# Altium schematic sheet SDEC944-xD_Alimentation_2-2.SchDoc: Alimentation 2/2
size 393 x 270 mm; CompanyName: Seccom; Address1: 521, rue du capt. François Garbit; Address2: 69440 Mornant; Address3: seccom@seccom.fr; Address4: www.seccom.fr; DocumentNumber: 3; SheetNumber: 3; SheetTotal: 22; PageSetup: Record=PageOptions|CenterHorizontal=True|CenterVertical=True|PrintScale=0.74|XCorrection=1.00|YCorrection=1.00|PrintKind=0|BorderSize=5000000|LeftOffset=0|BottomOffset=0|Orientation=2|PaperLength=1000|PaperWidth=1000|Scale=100|PaperSource=7|PrintQuality=-4|MediaType=1|DitherType=10|PaperKind=A4|PrintScaleMode=1
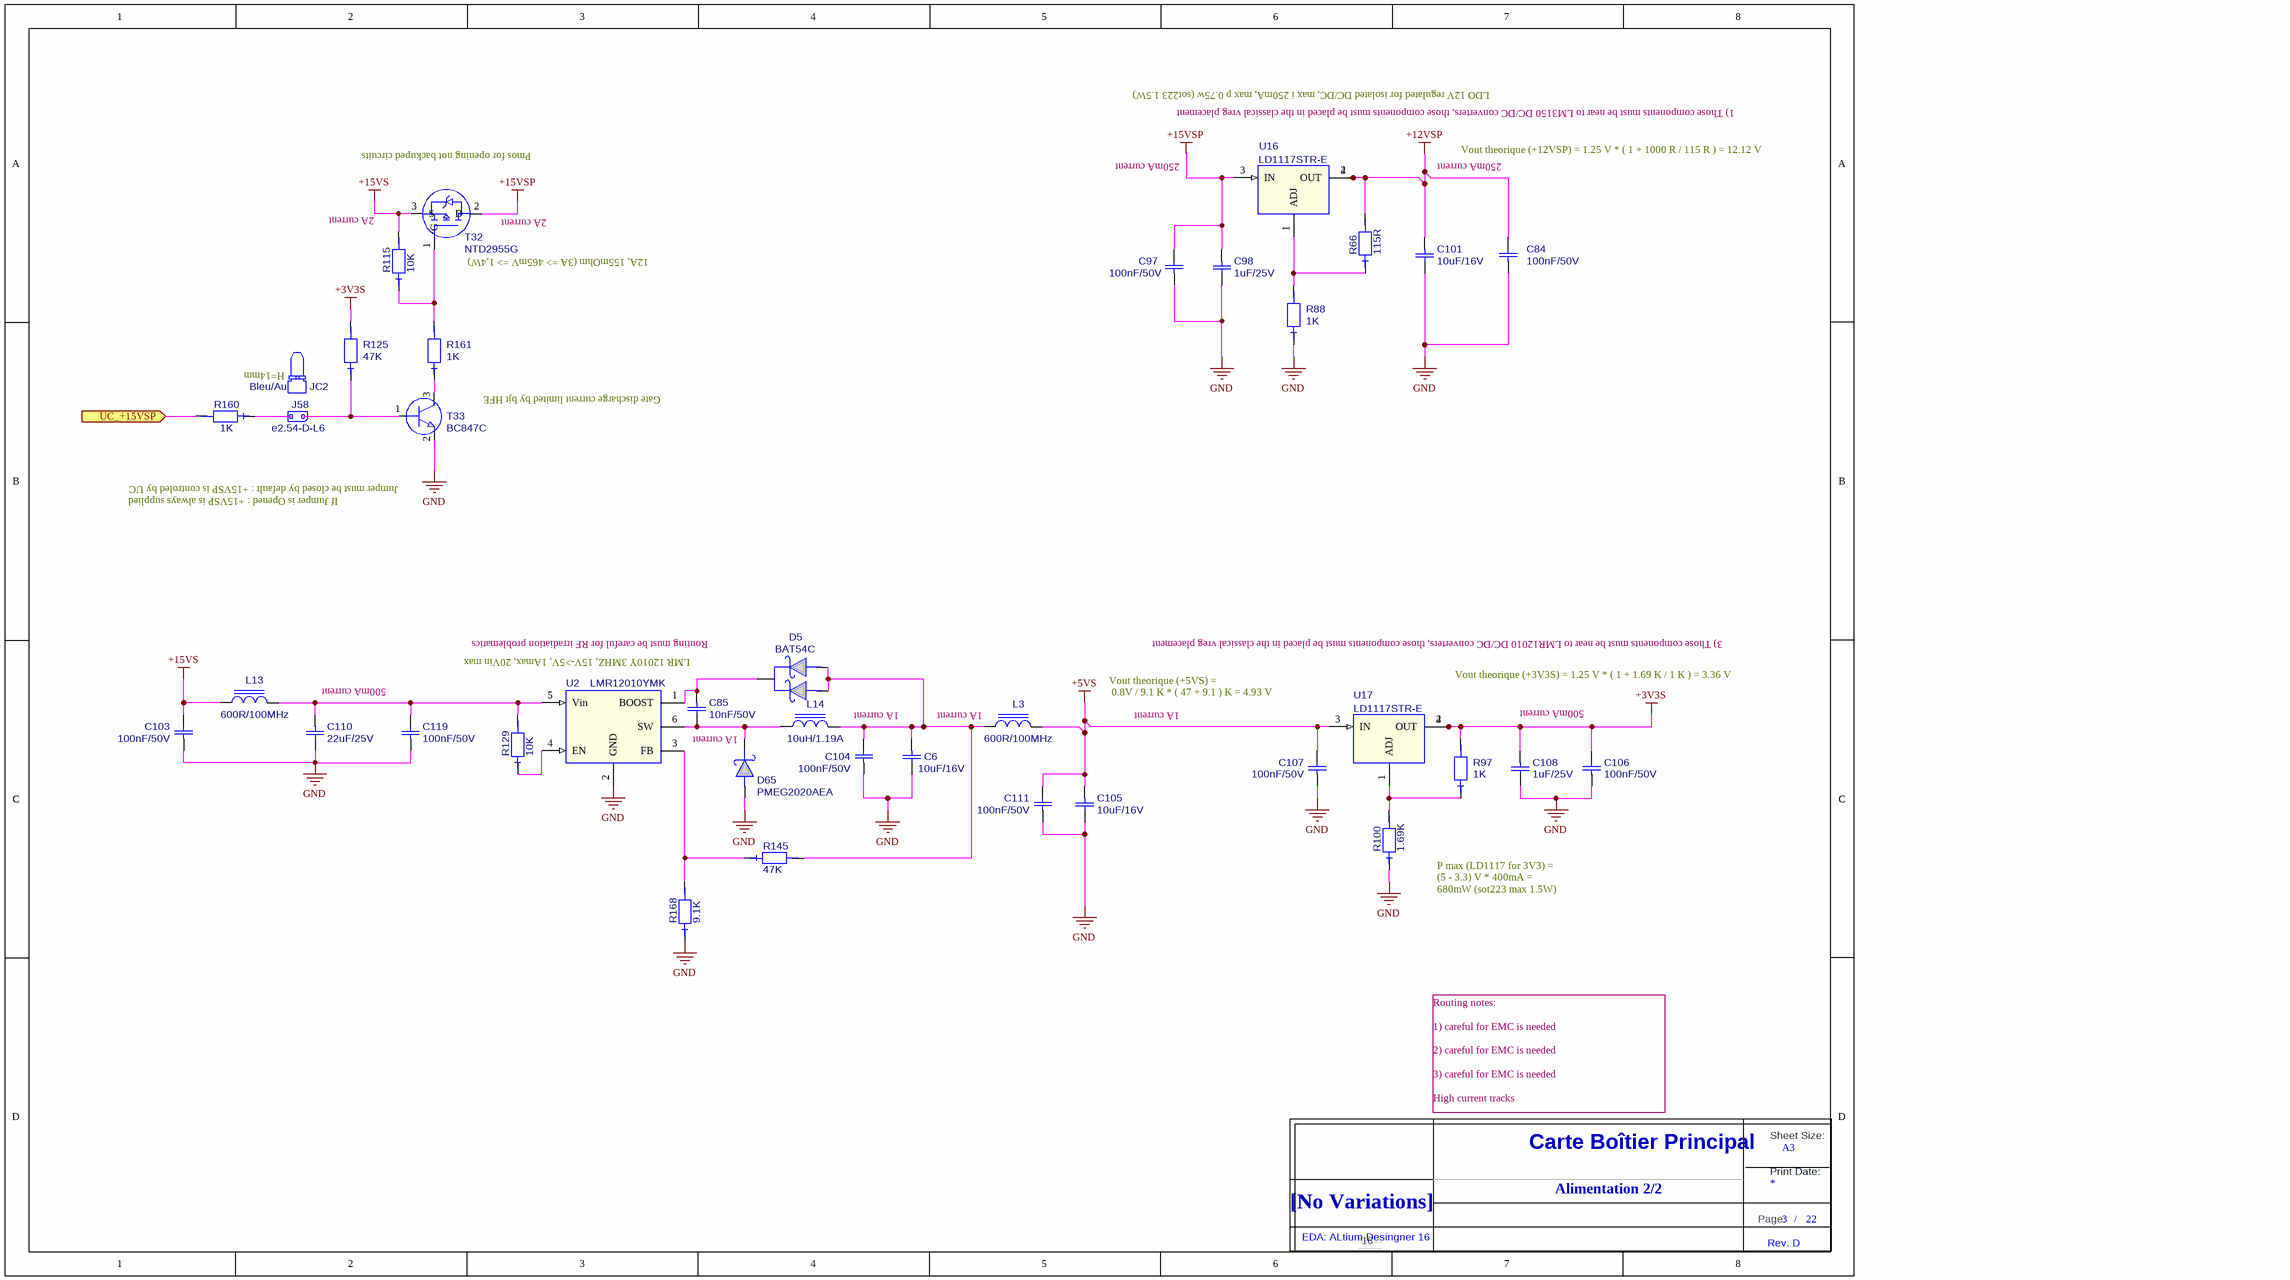
[diagram p0: SDEC944-xD_Alimentation_2-2.SchDoc]

## Parts
C6  value 10uF/16V  [0805_ReflowSoldering_CAP]  (hidden comment: C_0805_X5R_10%_10U-16V)
C84  value 100nF/50V  [0603_ReflowSoldering_CAP]  (hidden comment: C_0603_X7R_10%_100N-50V)
C85  value 10nF/50V  [0603_ReflowSoldering_CAP]  (hidden comment: C_0603_X7R_10%_10N-50V)
C97  value 100nF/50V  [0603_ReflowSoldering_CAP]  (hidden comment: C_0603_X7R_10%_100N-50V)
C98  value 1uF/25V  [0805_ReflowSoldering_CAP]  (hidden comment: C_0805_X5R_10%_1U-25V)
C101  value 10uF/16V  [0805_ReflowSoldering_CAP]  (hidden comment: C_0805_X5R_10%_10U-16V)
C103  value 100nF/50V  [0603_ReflowSoldering_CAP]  (hidden comment: C_0603_X7R_10%_100N-50V)
C104  value 100nF/50V  [0603_ReflowSoldering_CAP]  (hidden comment: C_0603_X7R_10%_100N-50V)
C105  value 10uF/16V  [0805_ReflowSoldering_CAP]  (hidden comment: C_0805_X5R_10%_10U-16V)
C106  value 100nF/50V  [0603_ReflowSoldering_CAP]  (hidden comment: C_0603_X7R_10%_100N-50V)
C107  value 100nF/50V  [0603_ReflowSoldering_CAP]  (hidden comment: C_0603_X7R_10%_100N-50V)
C108  value 1uF/25V  [0805_ReflowSoldering_CAP]  (hidden comment: C_0805_X5R_10%_1U-25V)
C110  value 22uF/25V  [1206_ReflowSoldering_CAP]  (hidden comment: C_1206_X5R_20%_22U-25V)
C111  value 100nF/50V  [0603_ReflowSoldering_CAP]  (hidden comment: C_0603_X7R_10%_100N-50V)
C119  value 100nF/50V  [0603_ReflowSoldering_CAP]  (hidden comment: C_0603_X7R_10%_100N-50V)
D5  BAT54C  [SOT23_3L_ReflowSoldering]
D65  PMEG2020AEA  [SOD323_ReflowSoldering]
J58  value e2.54-D-L6  [BAR_M_1X02D_L6_IS2.6_E2.54_G]  (hidden comment: CAVALIER_EMBASE_2PTS_E2.54)
JC2  value Bleu/Au  [NULL]  (hidden comment: CAVALIER_2.54_BLEU_DORE_LANGUETTE_14mm)
L3  value 600R/100MHz  [1206_ReflowSoldering_FERRITE]  (hidden comment: IND_FERRITE_1206_74279218)
L13  value 600R/100MHz  [1206_ReflowSoldering_FERRITE]  (hidden comment: IND_FERRITE_1206_74279218)
L14  value 10uH/1.19A  [SELF_WE-TPC_4.8x4.78_(type4828)]  (hidden comment: SELF_10UH_1.19A_744043100)
R66  value 115R  [0603_ReflowSoldering_RES]  (hidden comment: RES_0603_1%_100PPM_115R)
R88  value 1K  [0603_ReflowSoldering_RES]  (hidden comment: RES_0603_1%_100PPM_1K)
R97  value 1K  [0603_ReflowSoldering_RES]  (hidden comment: RES_0603_1%_100PPM_1K)
R100  value 1.69K  [0603_ReflowSoldering_RES]  (hidden comment: RES_0603_1%_100PPM_1.69K)
R115  value 10K  [0603_ReflowSoldering_RES]  (hidden comment: RES_0603_1%_100PPM_10K)
R125  value 47K  [0603_ReflowSoldering_RES]  (hidden comment: RES_0603_1%_100PPM_47K)
R129  value 10K  [0603_ReflowSoldering_RES]  (hidden comment: RES_0603_1%_100PPM_10K)
R145  value 47K  [0603_ReflowSoldering_RES]  (hidden comment: RES_0603_1%_100PPM_47K)
R160  value 1K  [0603_ReflowSoldering_RES]  (hidden comment: RES_0603_1%_100PPM_1K)
R161  value 1K  [0603_ReflowSoldering_RES]  (hidden comment: RES_0603_1%_100PPM_1K)
R168  value 9.1K  [0603_ReflowSoldering_RES]  (hidden comment: RES_0603_1%_100PPM_9.1K)
T32  NTD2955G  [DPAK_Specifique_1]
T33  BC847C  [SOT23_3L_ReflowSoldering]
Title_new  DNI  (value not drawn)  (graphical)
U2  LMR12010YMK  [SOT23_6L]
U16  LD1117STR-E  [SOT223]
U17  LD1117STR-E  [SOT223]

## Ports
UC_+15VSP (in)

## Nets
+3V3S: C106.1 C108.2 R97.2 R125.2 U17.2(OUT) U17.4(OUT)
+5VS: C105.2 C107.1 C111.1 L3.2 U17.3(IN)
+12VSP: C84.1 C101.2 R66.2 U16.2(OUT) U16.4(OUT)
+15VS: C103.1 L13.1 R115.2 T32.3(S)
+15VSP: C97.1 C98.2 T32.2(D) U16.3(IN)
GND: C6.1 C84.2 C97.2 C98.1 C101.1 C103.2 C104.2 C105.1 C106.2 C107.2 C108.1 C110.1 C111.2 C119.2 D65.A R88.1 R100.1 R168.1 T33.2(E) U2.2(GND)
UC_+15VSP: R160.2 ; port UC_+15VSP
NetC6_2: C6.2 C104.1 D5.1 D5.2 L3.1 L14.2 R145.2
NetC85_1: C85.1 D65.K L14.1 U2.6(SW)
NetC85_2: C85.2 D5.3 U2.1(BOOST)
NetC110_2: C110.2 C119.1 L13.2 R129.2 U2.5(Vin)
NetJ58_1: J58.1 R125.1 T33.1(B)
NetJ58_2: J58.2 R160.1
NetR66_1: R66.1 R88.2 U16.1(ADJ)
NetR97_1: R97.1 R100.2 U17.1(ADJ)
NetR115_1: R115.1 R161.2 T32.1(G)
NetR129_1: R129.1 U2.4(EN)
NetR145_1: R145.1 R168.2 U2.3(FB)
NetR161_1: R161.1 T33.3(C)

Not connected (* = marked no-connect by the designer): L14 3 4 5 6

## Notes on the sheet
- LDO 12V regulated for isolated DC/DC, max i 250mA, max p 0.75w (sot223 1.5W)
- 1) Those components must be near to LM3150 DC/DC converters, those components must be placed in the classical vreg placement
- Pmos for opening not backuped circuits
- 250mA current
- Vout theorique (+12VSP) = 1.25 V * ( 1 + 1000 R / 115 R ) = 12.12 V
- 2A current
- (near T32) 2A current
- (near T32) 12A, 155mOhm (3A => 465mV => 1,4W)
- (near JC2) H=14mm
- (near T33) Gate discharge current limited by bjt HFE
- If Jumper is Opened : +15VSP is always supplied
- Jumper must be closed by default : +15VSP is controled by UC
- Routing must be careful for RF irradiation problematics
- 3) Those components must be near to LMR12010 DC/DC converters, those components must be placed in the classical vreg placement
- 500mA current
- LMR 12010Y 3MHZ, 15V->5V, 1Amax, 20Vin max
- 1A current
- (near L3) 1A current
- Vout theorique (+5VS) =
  0.8V / 9.1 K * ( 47 + 9.1 ) K = 4.93 V
- Vout theorique (+3V3S) = 1.25 V * ( 1 + 1.69 K / 1 K ) = 3.36 V
- P max (LD1117 for 3V3) =
  (5 - 3.3) V * 400mA =
  680mW (sot223 max 1.5W)
- Routing notes:
  1) careful for EMC is needed
  2) careful for EMC is needed
  3) careful for EMC is needed
  High current tracks
- Alimentation 2/2
- 16
- (in symbol Title_new) Sheet Size:; Carte Boîtier Principal; A3; Print Date:; [No Variations]; Page:; /; EDA: ALtium Desingner 16; Rev. D

## Library data of the parts
C6 C101 C105 = C_0805_X5R_10%_10U-16V: Condensateur céramique, X5R, 10%, CMS 0805, 10uF/16V; Creation: FB (02/10/12); Boitier: 0805; Remarque: {Remarque}; Coeff: 1; Fabricant: Kemet; Ref Fab: C0805C106K4PAC; Verification: *; ComponentLink1URL: O:\_Documentation\Datasheets\Kemet\Condos_Ceramic_CMS.pdf; ComponentLink2URL: o:\_Documentation\Datasheets\_Boitiers\PASSIF_CMS\RC_0805_(2x1,25)_(Schneider).pdf; Config: *; ComponentLink1Description: Datasheet; ComponentLink2Description: Datasheet Boitier
C84 C97 C103 C104 C106 C107 C111 C119 = C_0603_X7R_10%_100N-50V: Condensateur céramique, X7R, 10%, CMS 0603, 100nF/50V; Creation: FB (29/02/12); Boitier: 0603; Remarque: {Remarque}; Fabricant: Kemet; Ref Fab: C0603C104K5RAC; Coeff: 1; ComponentLink1URL: O:\_Documentation\Datasheets\Kemet\Condos_Ceramic_CMS.pdf; ComponentLink2URL: o:\_Documentation\Datasheets\_BOITIERS\PASSIF_CMS\; Config: *; ComponentLink1Description: Datasheet; ComponentLink2Description: Datasheet Boitier; Supplier 1: Farnell; Supplier Part Number 1: 1288255
C85 = C_0603_X7R_10%_10N-50V: Condensateur céramique, X7R, 10%, CMS 0603; Creation: CHD; Boitier: 0603; Remarque: {Remarque}; Coeff: 1; Fabricant: Kemet; Ref Fab: C0603C103K5RAC; ComponentLink1URL: o:\_Documentation\Datasheets\Kemet\Condos_Ceramic_CMS.pdf; ComponentLink2URL: o:\_Documentation\Datasheets\_BOITIERS\PASSIF_CMS\; Config: *; ComponentLink1Description: Datasheet; ComponentLink2Description: Datasheet Boitier; Supplier 1: Farnell; Supplier Part Number 1: 1414609
C98 C108 = C_0805_X5R_10%_1U-25V: Condensateur céramique, X5R, 10%, CMS 0805; Creation: FB (07/03/12); Reference: 001834/00; Boitier: 0805; Remarque: {Remarque}; Coeff: 1; Fabricant: AVX; Ref Fab: 08053D105KAT2A; Verification: *; ComponentLink1URL: O:\_Documentation\Datasheets\AVX\Condensateurs_CMS_Ceramic_X5R.pdf; ComponentLink2URL: o:\_Documentation\Datasheets\_Boitiers\PASSIF_CMS\RC_0805_(2x1,25)_(Schneider).pdf; Config: *; ComponentLink1Description: Datasheet; ComponentLink2Description: Datasheet Boitier; Supplier Part Number 1: 1327695; Supplier Part Number 2: 6983409; Supplier 1: Farnell; Supplier 2: Radiospares
C110 = C_1206_X5R_20%_22U-25V: Condensateur céramique, X5R, 20%, CMS 1206, 22uF/25V; Creation: ZA (18/12/13); Reference: /01; Boitier: 1206; Remarque: {Remarque}; Fabricant: TDK; Coeff: 1; Ref Fab: C3216X5R1E226M160AB; Verification: *; ComponentLink1URL: O:\_Documentation\Datasheets\TDK\general_B11.pdf; ComponentLink2URL: o:\_Documentation\Datasheets\_BOITIERS\PASSIF_CMS\; ComponentLink1Description: Datasheet; ComponentLink2Description: Datasheet Boitier; Supplier 1: Farnell; Supplier Part Number 1: 2354129; Supplier 2: Mouser; Supplier Part Number 2: 810-C3216X5R1E226M
D5 = BAT54C: Diode Schottky double, BAT54 cathode com, Vrrm=30V, If=300mA, Vf=0.4Vmax, CMS; Creation: LJ (14/05/02); Reference: 000597/00; Boitier: SOT23_3L; Remarque: {Remarque}; Coeff: 1; Fabricant: NXP; Verification: LJ (14/05/02); ComponentLink1URL: O:\_Documentation\Datasheets\NXP\BAT54_series.pdf; ComponentLink2URL: o:\_Documentation\Datasheets\_BOITIERS\ACTIF_CMS\SOT\SOT_23_3P_(Schneider).PDF; Config: *; ComponentLink1Description: Datasheet; ComponentLink2Description: Datasheet Boitier; Ref Fab: BAT54C; Supplier 1: Farnell; Supplier Part Number 1: 1081192; Value: BAT54C
D65 = PMEG2020AEA: Diode Schottky, Vrrm=20V, If=2A, Vf=0.45V, CMS; Creation: PDP (10/07/12); Boitier: SOD323; Remarque: {Remarque}; Coeff: 1; Fabricant: NXP; Verification: *; ComponentLink1URL: o:\_Documentation\Datasheets\NXP\PMEG2020AEA.PDF; ComponentLink2URL: o:\_Documentation\Datasheets\_BOITIERS\ACTIF_CMS\SOD\SOD_80_(MLL34)_(Schneider).PDF; Config: *; ComponentLink1Description: Datasheet; ComponentLink2Description: Datasheet Boitier; Ref Fab: PMEG2020AEA; Value: PMEG2020AEA
J58 = CAVALIER_EMBASE_2PTS_E2.54: Barrette, e2.54, mâle, 1x2 picots 0.635², droit, long. contact 6, isol. 2.6mm, doré; Creation: LJ; Reference: 000048/02; Boitier: 1x02_e2.54_drt_L6mm; Remarque: Longueur contact idéale pour accueillir HE10; Verification: LJ (13/11/03); Coeff: 1; Fabricant: Samtec; Ref Fab: TSW-102-24-L-S; ComponentLink1URL: o:\_Documentation\Datasheets\Samtec\TSW_TH.PDF; Config: *; ComponentLink1Description: Datasheet; ComponentLink2Description: Datasheet Boitier
JC2 = CAVALIER_2.54_BLEU_DORE_LANGUETTE_14mm: Cavalier (Jumper) doré 2 points pour barrette au pas de 2.54mm, BLEU, avec languette, Hauteur globale 14mm, 3A, 250V; Creation: ZA (07/11/12); Boitier: 5.08x2.54_h14_e2.54mm; Remarque: {Remarque}; Coeff: 1; Fabricant: Harwin; Ref Fab: M7683-05; ComponentLink1URL: o:\_Documentation\Datasheets\Harwin\M7680-M7683.pdf; ComponentLink2URL: o:\_Documentation\Datasheets\Harwin\M7680-M7683.pdf; Config: *; ComponentLink2Description: Datasheet Boitier; ComponentLink1Description: Datasheet; Supplier 1: Farnell; Supplier Part Number 1: 3218466; Supplier 2: Mouser; Supplier Part Number 2: 855-M7683-05
L3 L13 = IND_FERRITE_1206_74279218: Inductance à ferrite multicouches CMS, imp=600R@100MHz, +/-25%, Rdc=100mR, I=2A; Creation: LJ (12/08/08); Reference: 000049/00; Boitier: 1206; Remarque: Alternative aux selfs de choc; Coeff: 1; Fabricant: Wurth Elektronik; Verification: *; ComponentLink1URL: o:\_Documentation\Datasheets\Wurth_Elektronik\74279218.pdf; ComponentLink2URL: o:\_Documentation\Datasheets\_Boitiers\PASSIF_CMS\RC_1206_(3,2x1,6)_(Schneider).pdf; Config: *; ComponentLink1Description: Datasheet; ComponentLink2Description: Datasheet Boitier; Ref Fab: 74279218
L14 = SELF_10UH_1.19A_744043100: Inductance bobinée CMS, 10uH +/- 10%, I=1.19A, Rdc=0.095R, SRF=40MHz, -40/+85°C; Creation: LJ (02/08/12); Boitier: 4.8x4.8_h2.8mm; Coeff: 1; Fabricant: Wurth Elektronik; Verification: *; ComponentLink1URL: O:\_Documentation\Datasheets\Wurth_Elektronik\744043100.pdf; ComponentLink2URL: O:\_Documentation\Datasheets\Wurth_Elektronik\744043100.pdf; Remarque: *; Config: *; ComponentLink1Description: Datasheet; ComponentLink2Description: Datasheet Boitier; Ref Fab: 744043100
R66 = RES_0603_1%_100PPM_115R: Résistance, 0.100W, 1%, 100ppm, 75V, 115R; Creation: PDP (03/10/12); Boitier: 0603; Remarque: {Remarque}; Fabricant: Vishay; Ref Fab: CRCW0603115RFKEA; Coeff: 1; Verification: *; ComponentLink1URL: O:\_Documentation\Datasheets\Vishay\Resistances_D-CRCWe3.pdf; ComponentLink2URL: o:\_Documentation\Datasheets\_BOITIERS\PASSIF_CMS\; Config: *; ComponentLink1Description: Datasheet; ComponentLink2Description: Datasheet Boitier; Supplier 1: Mouser; Supplier Part Number 1: 71-CRCW0603-115-E3; Supplier 2: Farnell; Supplier Part Number 2: 2141284
R88 R97 R160 R161 = RES_0603_1%_100PPM_1K: Résistance, 0.100W, 1%, 100ppm, 75V, 1K; Creation: JPL (05/07/12); Boitier: 0603; Remarque: {Remarque}; Fabricant: Vishay; Ref Fab: CRCW06031K00FKEA; Coeff: 1; Verification: *; ComponentLink1URL: O:\_Documentation\Datasheets\Vishay\Resistances_D-CRCWe3.pdf; ComponentLink2URL: o:\_Documentation\Datasheets\_BOITIERS\PASSIF_CMS\; Config: *; ComponentLink1Description: Datasheet; ComponentLink2Description: Datasheet Boitier; Supplier 1: Farnell; Supplier 2: RadioSpares; Supplier Part Number 1: 1469740; Supplier Part Number 2: 6789875
R100 = RES_0603_1%_100PPM_1.69K: Résistance, 0.100W, 1%, 100ppm, 75V, 1.69K; Creation: PDP (03/10/12); Boitier: 0603; Remarque: {Remarque}; Fabricant: Vishay; Ref Fab: CRCW06031K69FKEA; Coeff: 1; Verification: *; ComponentLink1URL: O:\_Documentation\Datasheets\Vishay\Resistances_D-CRCWe3.pdf; ComponentLink2URL: o:\_Documentation\Datasheets\_BOITIERS\PASSIF_CMS\; Config: *; ComponentLink1Description: Datasheet; ComponentLink2Description: Datasheet Boitier; Supplier 1: Farnell; Supplier Part Number 1: 1692520; Supplier 2: Mouser; Supplier Part Number 2: 71-CRCW0603-1.69K-E3
R115 R129 = RES_0603_1%_100PPM_10K: Résistance, 0.100W, 1%, 100ppm, 75V, 10K; Creation: JPL (05/07/12); Boitier: 0603; Remarque: {Remarque}; Coeff: 1; Fabricant: Vishay; Ref Fab: CRCW060310K0FKEA; Verification: *; ComponentLink1URL: O:\_Documentation\Datasheets\Vishay\Resistances_D-CRCWe3.pdf; ComponentLink2URL: o:\_Documentation\Datasheets\_BOITIERS\PASSIF_CMS\; Config: *; ComponentLink1Description: Datasheet; ComponentLink2Description: Datasheet Boitier; Supplier 1: Farnell; Supplier Part Number 1: 1469748; Supplier 2: RadioSpares; Supplier Part Number 2: 6789667
R125 R145 = RES_0603_1%_100PPM_47K: Résistance, 0.100W, 1%, 100ppm, 75V, 47K; Creation: JPL (05/07/12); Boitier: 0603; Remarque: {Remarque}; Fabricant: Vishay; Ref Fab: CRCW060347K0FKEA; Coeff: 1; Verification: *; ComponentLink1URL: O:\_Documentation\Datasheets\Vishay\Resistances_D-CRCWe3.pdf; ComponentLink2URL: o:\_Documentation\Datasheets\_BOITIERS\PASSIF_CMS\; Config: *; ComponentLink1Description: Datasheet; ComponentLink2Description: Datasheet Boitier; Supplier 1: Farnell; Supplier 2: RadioSpares; Supplier Part Number 1: 1469811; Supplier Part Number 2: 6790425
R168 = RES_0603_1%_100PPM_9.1K: Résistance, 0.100W, 1%, 100ppm, 75V, 9.1K; Creation: PDP (03/09/12); Boitier: 0603; Remarque: {Remarque}; Fabricant: Vishay; Ref Fab: CRCW06039K10FKEA; Coeff: 1; ComponentLink1URL: O:\_Documentation\Datasheets\Vishay\Resistances_D-CRCWe3.pdf; ComponentLink2URL: o:\_Documentation\Datasheets\_BOITIERS\PASSIF_CMS\; Config: *; ComponentLink1Description: Datasheet; ComponentLink2Description: Datasheet Boitier; Supplier 1: Mouser; Supplier Part Number 1: 71-CRCW0603-9.1K-E3; Supplier 2: Farnell; Supplier Part Number 2: 1469842RL
T32 = NTD2955G: Transistor Mosfet P, Vdss=60V, Id=12A, Rdson=0.155R, -55/+175°C, CMS; Boitier: DPAK; Creation: PDP (13/07/12); Coeff: 1; Fabricant: ON Semiconductor; Verification: *; ComponentLink1URL: O:\_Documentation\Datasheets\ON_Semiconductors\NTD2955.PDF; ComponentLink2URL: o:\_Documentation\Datasheets\_BOITIERS\ACTIF_CMS\; Config: *; ComponentLink1Description: Datasheet; Ref Fab: NTD2955G; Supplier 1: Farnell; Supplier Part Number 1: 2101431; Supplier 2: Mouser; Supplier Part Number 2: 863-NTD2955G; ComponentLink2Description: Datasheet Boitier; Value: NTD2955G
T33 = BC847C: Transistor NPN, Vce=50V, Ic=0.1A, hfe=420~800, 0.25W, CMS; Creation: GO (08/07/05); Verification: LJ (21/07/05); Reference: 000329/00; Boitier: SOT23_3L; Remarque: Complementaires aux BC856-860; Fabricant: NXP; Coeff: 1; Ref Fab: BC847C; ComponentLink1URL: O:\_Documentation\Datasheets\NXP\BC847.pdf; ComponentLink2URL: o:\_Documentation\Datasheets\_BOITIERS\ACTIF_CMS\SOT\SOT_23_3P_(Schneider).PDF; Config: *; ComponentLink1Description: Datasheet; Value: BC847C; Supplier 1: Farnell; Supplier Part Number 1: 1081235; ComponentLink2Description: Datasheet Boitier
Title_new = Title_new
U2 = LMR12010YMK: Régulateur ajustable step down, 0.8~20V, 1A, Vin=3~20V, -40/+125°C, CMS; Creation: PDP (10/07/12); Verification: LJ (02/08/12); Boitier: TSOT-6; Remarque: {Remarque}; Coeff: 1; Fabricant: National Semiconductor; ComponentLink1URL: O:\_Documentation\Datasheets\National_SemiConductors\LMR12010.pdf; ComponentLink2URL: o:\_Documentation\Datasheets\_Boitiers\ACTIF_CMS\; ComponentLink1Description: Datasheet; ComponentLink2Description: Datasheet Boitier; Ref Fab: LMR12010YMK; Value: LMR12010YMK; Supplier 1: Farnell; Supplier Part Number 1: 2060645; Supplier 2: Mouser; Supplier Part Number 2: 926-LMR12010YMKENOPB
U16 U17 = LD1117STR-E: Régulateur de tension ajustable positif, 1.25~15V, 0.8A, LDO (1V), Vin=15Vmax, CMS; Creation: LJ (04/07/11); Reference: 001683/00; Remarque: {Remarque}; Coeff: 1; Fabricant: ST; Boitier: SOT223; ComponentLink2URL: o:\_Documentation\Datasheets\_Boitiers\ACTIF_CMS\SOT & TSOT\SOT223_4_(Schneider).pdf; Config: *; ComponentLink1URL: o:\_Documentation\Datasheets\ST\LD1117.pdf; ComponentLink1Description: Datasheet; ComponentLink2Description: Datasheet Boitier; Ref Fab: LD1117STR-E; Value: LD1117STR-E